# EAGLE design clock (EAGLE 9.6.2)
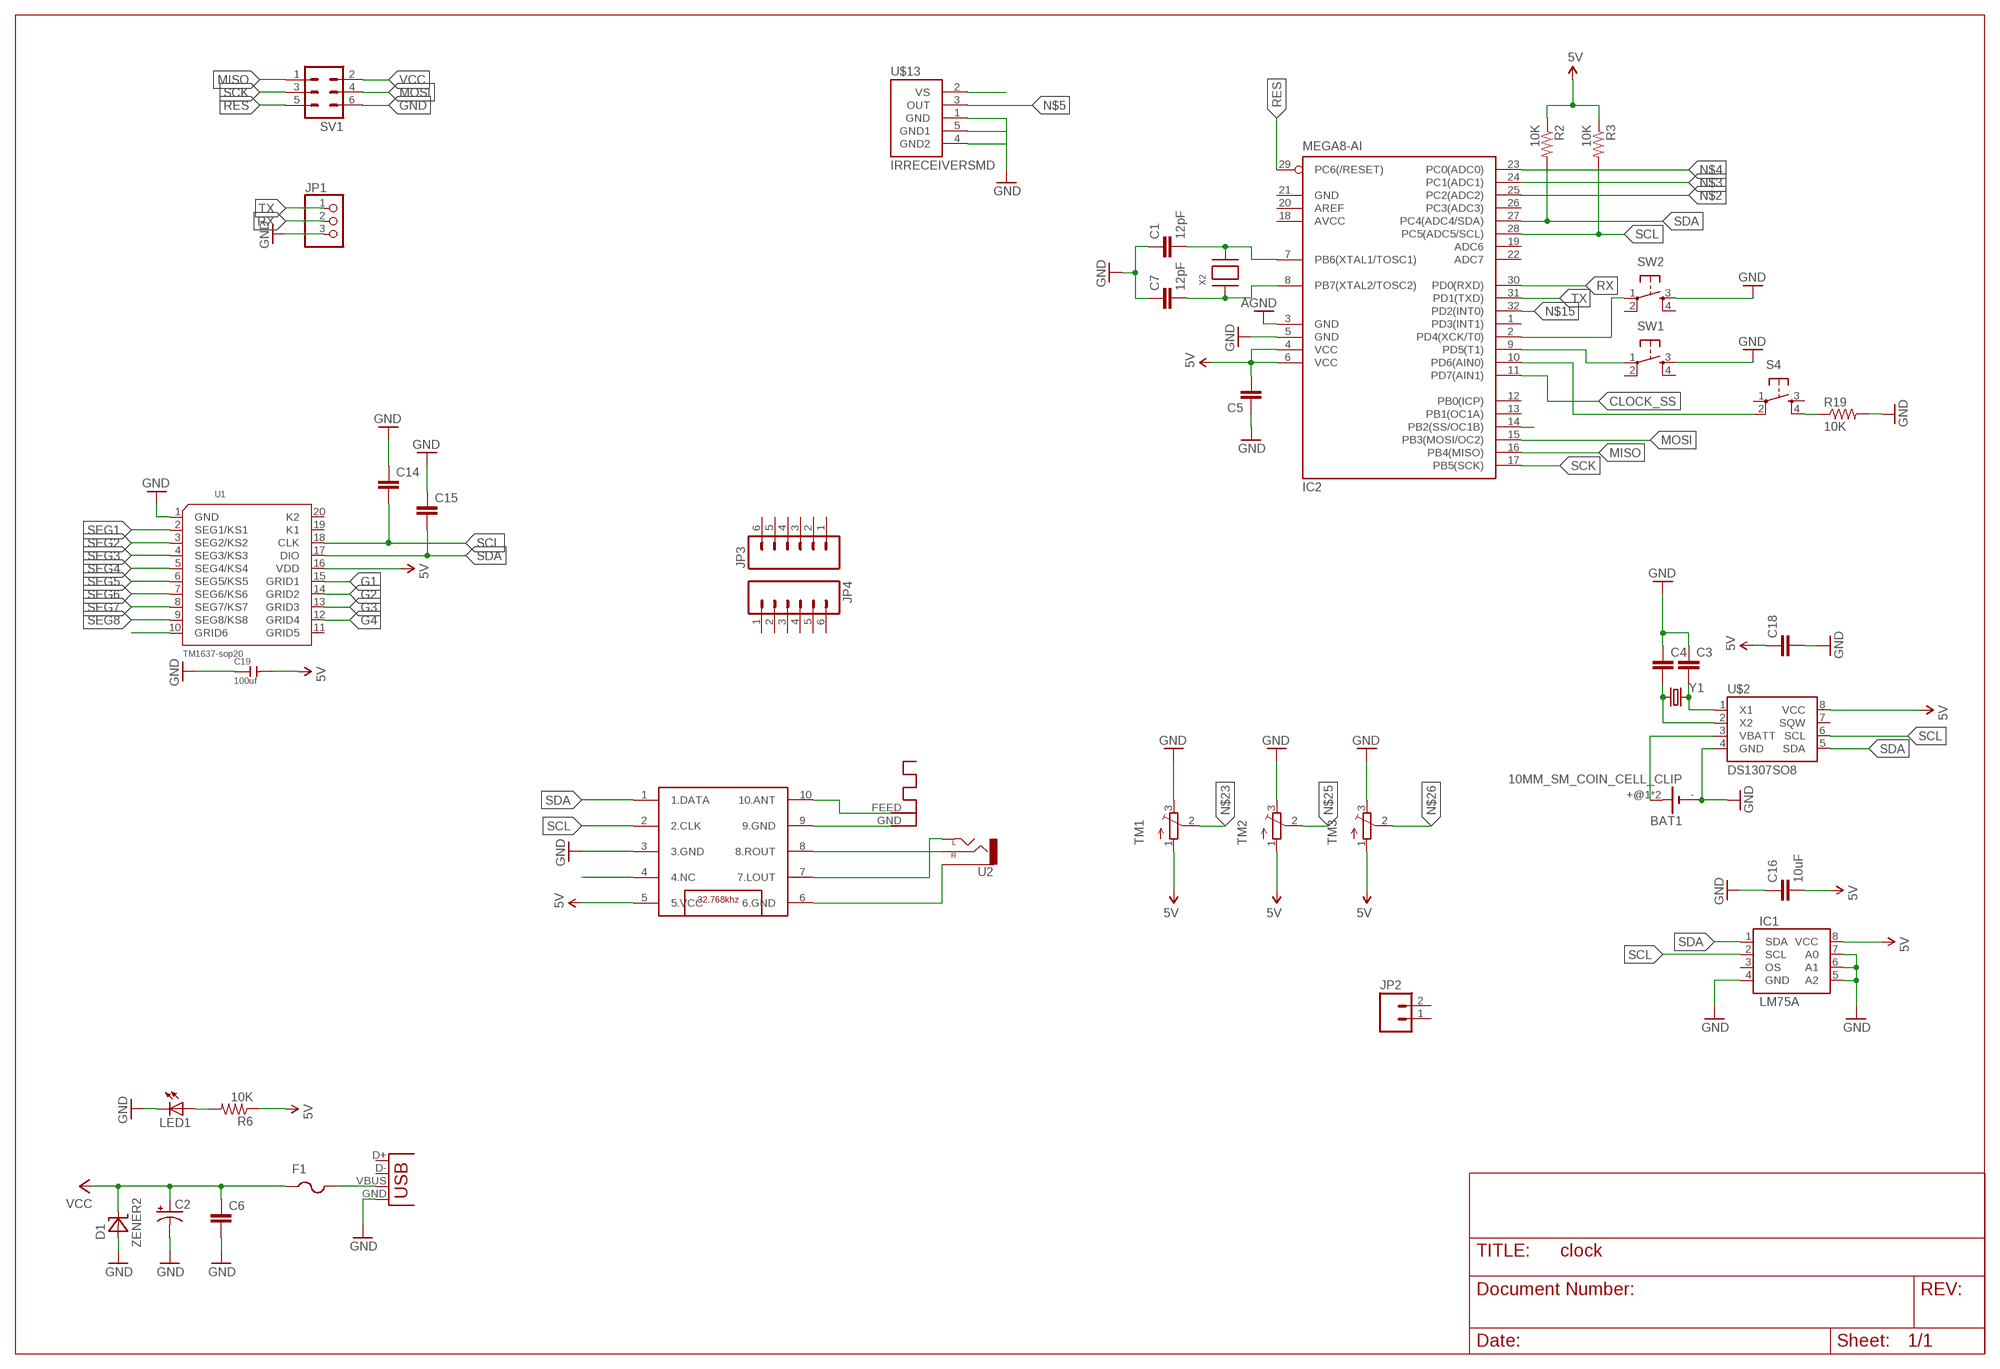
[diagram p0: schematic, sheet 1]

## Parts
ANT1  ANTENNA  [RN-ANT]
BAT1  10MM_SM_COIN_CELL_CLIP  [10MM_SM_COIN_CELL_CLIP]
C1  12pF  C-EUC0603  [C0603]
C2  CPOL-USB  [PANASONIC_B]
C3  C-EUC0603  [C0603]
C4  C-EUC0603  [C0603]
C5  C-EUC0603  [C0603]
C6  C-EUC0603  [C0603]
C7  12pF  C-EUC0603  [C0603]
C14  C-EUC0603  [C0603]
C15  C-EUC0603  [C0603]
C16  10uF  C-EUC0603  [C0603]
C18  C-EUC0603  [C0603]
C19  100uf  CERAMIC-100UF-6.3V-20%-X5R(1206)  [C1206]
D1  ZENER2  [SOD123]
F1  PTCFUSE-1206  [R1206]
IC1  LM75A  [SO8]
IC2  MEGA8-AI  [TQFP32-08]
JP1  PINHD-1X3CB  [1X03-CLEANBIG]
JP2  M02PTH  [1X02]
JP3  M06SIP  [1X06]
JP4  M06SIP  [1X06]
LED1  LED0603  [LED-0603]
R2  10K  R-US_R0603  [R0603]
R3  10K  R-US_R0603  [R0603]
R6  10K  R-US_R0603  [R0603]
R19  10K  R-US_R0603  [R0603]
S4  TAC_SWITCHSMD  [TACTILE_SWITCH_SMD]
SV1  MA03-2  [MA03-2]
SW1  TAC_SWITCHSMD  [TACTILE_SWITCH_SMD]
SW2  TAC_SWITCHSMD  [TACTILE_SWITCH_SMD]
TM1  TRIMPOTTC33X  [TC33X]
TM2  TRIMPOTTC33X  [TC33X]
TM3  TRIMPOTTC33X  [TC33X]
U1  TM1637-sop20  DRIVER-TM1637(SOP20)  [SOP20-1.27-12.7X7.65MM]
U2  AUDIO-JACKSMD  [STEREOJACK2.5MM_SMD]
U$2  DS1307SO8  [SO08]
U$13  IRRECEIVERSMD  [TSOP8523]
U$14  TEA5767  [TJ-102BC]
X1  USB-MICROB  [USB-MICROB]
X2  XTAL-3.2X1.5  [XTAL3215]
Y1  CRYSTALTC26H  [TC26H]

## Nets
5V: C5.2 C16.2 C18.1 C19.2 IC1.8(VCC) IC2.4(VCC) IC2.6(VCC) R2.1 R3.1 R6.1 TM1.1(A) TM2.1(A) TM3.1(A) U1.16(VDD) U$2.8(VCC) U$14.5(5.VCC)
AGND: IC2.3(GND)
CLOCK_SS: IC2.11(PD7(AIN1))
G1: U1.15(GRID1)
G2: U1.14(GRID2)
G3: U1.13(GRID3)
G4: U1.12(GRID4)
GND: BAT1.- C1.1 C2.- C3.1 C4.1 C5.1 C6.2 C7.1 C14.1 C15.1 C16.1 C18.2 C19.1 D1.A IC1.4(GND) IC1.5(A2) IC1.6(A1) IC1.7(A0) IC2.5(GND) JP1.3 LED1.C R19.2 SV1.6 SW1.3 SW2.3 TM1.3(E) TM2.3(E) TM3.3(E) U1.1(GND) U$2.4(GND) U$13.1(GND) U$13.4(GND2) U$13.5(GND1) U$14.3(3.GND) X1.GND
MISO: IC2.16(PB4(MISO)) SV1.1
MOSI: IC2.15(PB3(MOSI/OC2)) SV1.4
N$2: IC2.25(PC2(ADC2))
N$3: IC2.24(PC1(ADC1))
N$4: IC2.23(PC0(ADC0))
N$5: U$13.3(OUT)
N$6: U2.5(SLEEVE) U$14.6(6.GND)
N$7: U2.4(RIGHT) U$14.8(8.ROUT)
N$8: BAT1.+@1(+) BAT1.+@2(+) U$2.3(VBATT)
N$9: U2.1(LEFT) U$14.7(7.LOUT)
N$10: C4.2 U$2.2(X2) Y1.1
N$11: C3.2 U$2.1(X1) Y1.2
N$12: ANT1.FEED U$14.10(10.ANT)
N$14: IC2.9(PD5(T1)) SW1.1
N$15: IC2.32(PD2(INT0))
N$16: ANT1.GND U$14.9(9.GND)
N$18: U$14.4(4.NC)
N$19: IC2.2(PD4(XCK/T0)) SW2.1
N$20: U$13.2(VS)
N$23: TM1.2(S)
N$24: U1.10(GRID6)
N$25: TM2.2(S)
N$26: TM3.2(S)
N$47: IC2.10(PD6(AIN0)) S4.2
N$49: IC2.14(PB2(SS/OC1B))
N$52: F1.2 X1.VBUS
N$54: C1.2 IC2.7(PB6(XTAL1/TOSC1)) X2.P$2
N$57: R19.1 S4.4
N$58: C7.2 IC2.8(PB7(XTAL2/TOSC2)) X2.P$1
N$60: LED1.A R6.2
RES: IC2.29(PC6(/RESET)) SV1.5
RX: IC2.30(PD0(RXD)) JP1.2
SCK: IC2.17(PB5(SCK)) SV1.3
SCL: C14.2 IC1.2(SCL) IC2.28(PC5(ADC5/SCL)) R3.2 U1.18(CLK) U$2.6(SCL) U$14.2(2.CLK)
SDA: C15.2 IC1.1(SDA) IC2.27(PC4(ADC4/SDA)) R2.2 U1.17(DIO) U$2.5(SDA) U$14.1(1.DATA)
SEG1: U1.2(SEG1/KS1)
SEG2: U1.3(SEG2/KS2)
SEG3: U1.4(SEG3/KS3)
SEG4: U1.5(SEG4/KS4)
SEG5: U1.6(SEG5/KS5)
SEG6: U1.7(SEG6/KS6)
SEG7: U1.8(SEG7/KS7)
SEG8: U1.9(SEG8/KS8)
TX: IC2.31(PD1(TXD)) JP1.1
VCC: C2.+ C6.1 D1.C F1.1 SV1.2
Unconnected: IC1.3(OS) IC2.1(PD3(INT1)) IC2.12(PB0(ICP)) IC2.13(PB1(OC1A)) IC2.19(ADC6) IC2.20(AREF) IC2.22(ADC7) IC2.26(PC3(ADC3)) JP2.1 JP2.2 JP3.1 JP3.2 JP3.3 JP3.4 JP3.5 JP3.6 JP4.1 JP4.2 JP4.3 JP4.4 JP4.5 JP4.6 S4.1 S4.3 SW1.2 SW1.4 SW2.2 SW2.4 U1.11(GRID5) U1.19(K1) U1.20(K2) U$2.7(SQW) X1.D+ X1.D-

## Power pins joined to a net without a drawn wire
AVCC: IC2.18(AVCC)
GND: IC2.21(GND)

## Library data of the parts
ANT1 = adafruit:ANTENNA
BAT1 = battery:10MM_SM_COIN_CELL_CLIP: Battery cell clip for CR927 Source: KEYSTONE ELECTRONICS CORP. www.keyelco.com, ASTORIA, N.Y. 11105-2017 PART ANME 10mm SM COIN CELl CLIP DWG NO. 3030
C1 C3-C7 C14-C16 C18 = rcl:C-EU: CAPACITOR, European symbol
C2 = adafruit:CPOL-US: POLARIZED CAPACITOR, American symbol
C19 = Seeed-Capacitor:CERAMIC-100UF-6.3V-20%-X5R(1206): 302010183; MPN: GRM31CR60J107ME39L
D1 = smt_diodes:ZENER
F1 = adafruit:PTCFUSE: PTC fuses, resettable thermistors
IC1 = philips-6:LM75A
IC2 = atmel:MEGA8: MICROCONTROLLER 8 Kbytes FLASH, 1 kbytes SRAM, 512 bytes EEPROM, USART, 6-channel 10 bit ADC, 2-channel 8 bit ADC Pin compatible with Atmega48, ATMega88, ATMega168 Source: avr.lbr; MPN: ATMEGA8-16AU; OC_FARNELL: 9171371; OC_NEWARK: 73M8863
JP1 = adafruit:PINHD-1X3: PIN HEADER
JP2 = SparkFun:M02: Header 2 Standard 2-pin 0.1" header. Use with straight break away headers (SKU : PRT-00116), right angle break away headers (PRT-00553), swiss pins (PRT-00743), machine pins (PRT-00117), and female headers (PRT-00115). Molex polarized connector foot print use with SKU : PRT-08233 with associated crimp pins and housings.
JP3 JP4 = SparkFun:M06: Header 6 Standard 6-pin 0.1" header. Use with straight break away headers (SKU : PRT-00116), right angle break away headers (PRT-00553), swiss pins (PRT-00743), machine pins (PRT-00117), and female headers (PRT-00115). Molex polarized connector foot print use with SKU : PRT-08094 with associated crimp pins and housings. NOTES ON THE VARIANTS LOCK and LOCK_LONGPADS... This footprint was designed to help hold the alignment of a through-hole component (i.e. 6-pin header) while soldering it into place. You may notice that each hole has been shifted either up or down by 0.005 of an inch from it's more standard position (which is a perfectly straight line). This slight alteration caused the pins (the squares in the middle) to touch the edges of the holes. Because they are alternating, it causes a "brace" to hold the component in place. 0.005 has proven to be the perfect amount of "off-center" position when using our standard breakaway headers. Although looks a little odd when you look at the bare footprint, once you have a header in there, the alteration is very hard to notice. Also, if you push a header all the way into place, it is covered up entirely on the bottom side. This idea of altering the position of holes to aid alignment will be further integrated into the Sparkfun Library for other footprints. It can help hold any component with 3 or more connection pins.
LED1 = SparkFun:LED: LEDs Standard schematic elements and footprints for 5mm, 3mm, 1206, and 0603 sized LEDs. 5mm - Spark Fun Electronics SKU : COM-00529 (and others)
R2 R3 R6 R19 = rcl:R-US_: RESISTOR, American symbol
S4 SW1 SW2 = SparkFun:TAC_SWITCH: Momentary Switch Button commonly used for reset or general input. Spark Fun Electronics SKU : COM-00097
SV1 = con-lstb:MA03-2: PIN HEADER; OC_FARNELL: unknown; OC_NEWARK: unknown
TM1-TM3 = adafruit:TRIMPOT: SMT trimmer potentiometer part number TC33X http://www.ladyada.net/library/eagle
U1 = Seeed-IC:DRIVER-TM1637(SOP20): 310040027; MPN: TM1637
U2 = SparkFun:AUDIO-JACK: 3.5mm Audio Jack Simple 3.5mm common PCB mount audio jack. SKU: PRT-08032
U$2 = SparkFun:DS1307
U$13 = SparkFun:IRRECEIVER: Description: IR receiver with built in demodulation and filtering. SparkFun SKU: SEN-08545
U$14 = TEA5767:TEA5767
X1 = SparkFun:USB: USB Connectors USB-B-PTH is fully proven SKU : PRT-00139 USB-miniB is fully proven SKU : PRT-00587 USB-A-PCB is untested. USB-A-H is throughly reviewed, but untested. Spark Fun Electronics SKU : PRT-00437 USB-B-SMT is throughly reviewed, but untested. Needs silkscreen touching up. USB-A-S has not been used/tested USB-MB-H has not been used/tested
X2 = adafruit:XTAL: Low cost SMT crystals, no capacitors included http://www.ladyada.net/library/eagle
Y1 = SparkFun:CRYSTAL: Crystals Various standard crystals. Proven footprints. Spark Fun Electronics SKU : COM-00534

## Board
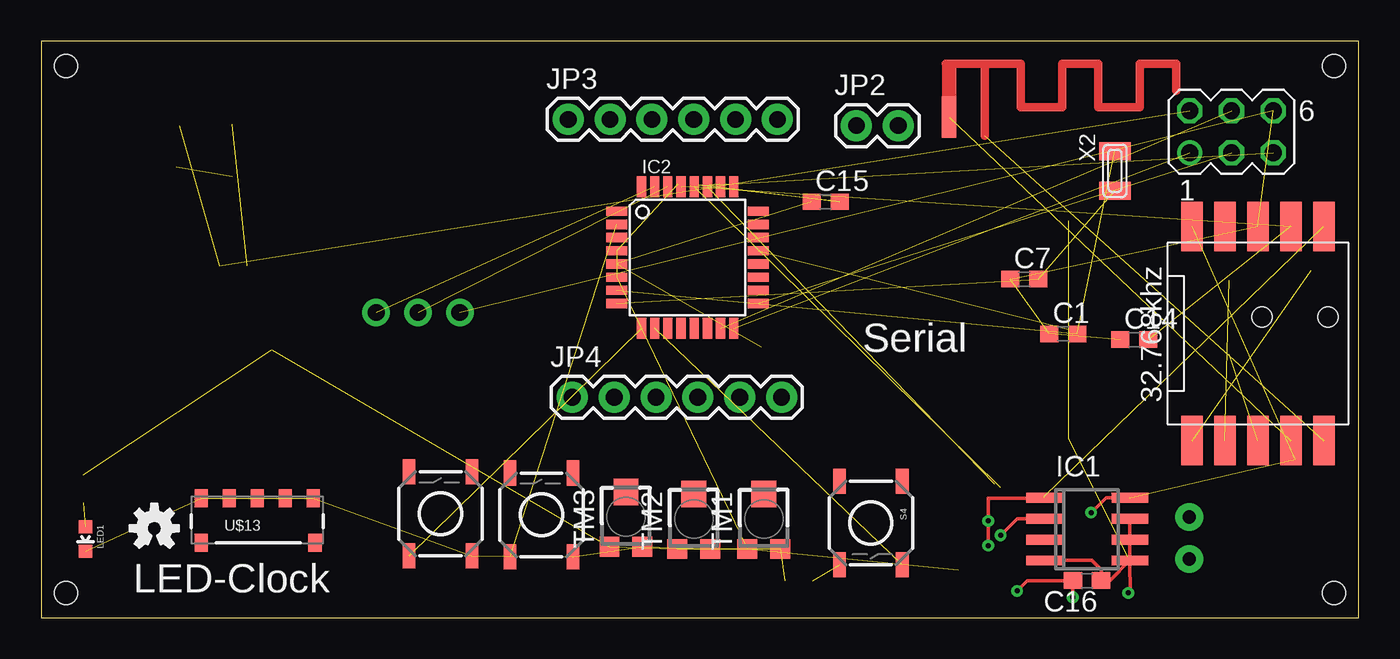
[diagram p1: board, top side]
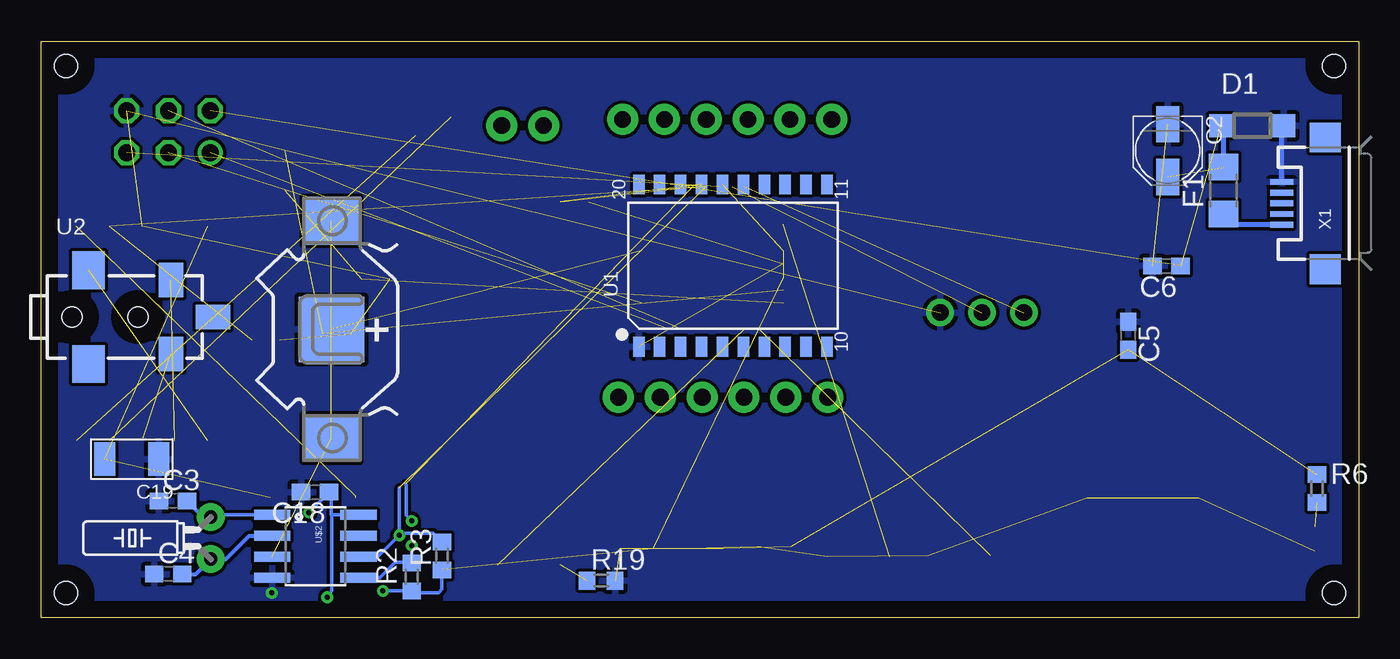
[diagram p2: board, bottom side, seen from below]

Size 80 x 35 mm. Coordinates in mm from the lower left corner, seen from the top.
Outline: 0,0 80,0 80,35 0,35 0,0
Copper layers (1*16): Top 0.035mm / dielectric 1.5mm / Bottom 0.035mm
Design rules "default *": minimum track width 8mil, minimum drill 12mil, track to track 8mil, track to pad 8mil, pad to pad 8mil, via to via 8mil, smd to smd 8mil, copper to edge 40mil, drill to drill 8mil, minimum pad ring 10mil, minimum via ring 8mil, stop-mask expansion 4mil, vias tented up to drill 0mil, thermal gap 10mil
Holes 1.4 mm at 78.5,33.5 1.5,33.5 78.5,1.5 1.5,1.5

### Footprints (pad centres in the part's own frame; a part is rotated, then mirrored left to right if it is on the bottom)
RN-ANT = smd 0.025 x 0.025: FEED 0,2.159 | smd 2.54 x 0.889: GND -1.143,0
10MM_SM_COIN_CELL_CLIP = smd 2.9 x 3.5: +@1 -6.6,0; +@2 6.6,0 | smd 3.96 x 3.96: - 0,0
C0603 = smd 1.1 x 1: 1 -0.85,0; 2 0.85,0
PANASONIC_B = smd 2.2 x 1.4: + 1.6,0; - -1.6,0
C1206 = smd 1.27 x 2.032: 1 -1.651,0; 2 1.651,0
SOD123 = smd 1.4 x 1.4: A 1.9,0; C -1.9,0
R1206 = smd 1.6 x 1.803: 1 -1.422,0; 2 1.422,0
SO8 = smd 0.6 x 2.2: 1 -1.905,-2.6; 2 -0.635,-2.6; 3 0.635,-2.6; 4 1.905,-2.6; 5 1.905,2.6; 6 0.635,2.6; 7 -0.635,2.6; 8 -1.905,2.6
TQFP32-08 = smd 1.27 x 0.559: 1 -4.293,2.8; 2 -4.293,2; 3 -4.293,1.2; 4 -4.293,0.4; 5 -4.293,-0.4; 6 -4.293,-1.2; 7 -4.293,-2; 8 -4.293,-2.8; 17 4.293,-2.8; 18 4.293,-2; 19 4.293,-1.2; 20 4.293,-0.4; 21 4.293,0.4; 22 4.293,1.2; 23 4.293,2; 24 4.293,2.8 | smd 0.559 x 1.27: 9 -2.8,-4.293; 10 -2,-4.293; 11 -1.2,-4.293; 12 -0.4,-4.293; 13 0.4,-4.293; 14 1.2,-4.293; 15 2,-4.293; 16 2.8,-4.293; 25 2.8,4.293; 26 2,4.293; 27 1.2,4.293; 28 0.4,4.293; 29 -0.4,4.293; 30 -1.2,4.293; 31 -2,4.293; 32 -2.8,4.293
1X03-CLEANBIG = drill 1.016 pad 1.676: 1 -2.54,0; 2 0,0; 3 2.54,0
1X02 = drill 1.016 pad 1.88: 1 0,0; 2 2.54,0
1X06 = drill 1.016 pad 1.88: 1 0,0; 2 2.54,0; 3 5.08,0; 4 7.62,0; 5 10.16,0; 6 12.7,0
LED-0603 = smd 0.8 x 0.8: A 0,-0.75; C 0,0.75
R0603 = smd 1 x 1.1: 1 -0.85,0; 2 0.85,0
TACTILE_SWITCH_SMD = smd 1.524 x 0.762: 1 -2.54,1.905; 2 2.54,1.905; 3 -2.54,-1.905; 4 2.54,-1.905
MA03-2 = drill 1.016: 1 -2.54,-1.27 | drill 1.016 octagon: 2 -2.54,1.27; 3 0,-1.27; 4 0,1.27; 5 2.54,-1.27; 6 2.54,1.27
TC33X = smd 1.2 x 1.2: 1 -1,-1.825; 3 1,-1.825 | smd 1.5 x 1.6: 2 0,1.5
SOP20-1.27-12.7X7.65MM = smd 0.7 x 1.2: 1 -5.715,-4.925; 2 -4.445,-4.925; 3 -3.175,-4.925; 4 -1.905,-4.925; 5 -0.635,-4.925; 6 0.635,-4.925; 7 1.905,-4.925; 8 3.175,-4.925; 9 4.445,-4.925; 10 5.715,-4.925; 11 5.715,4.925; 12 4.445,4.925; 13 3.175,4.925; 14 1.905,4.925; 15 0.635,4.925; 16 -0.635,4.925; 17 -1.905,4.925; 18 -3.175,4.925; 19 -4.445,4.925; 20 -5.715,4.925
STEREOJACK2.5MM_SMD = smd 1.5 x 2.1: 1 6,2.25; 4 6,-2.25 | smd 2.1 x 1.5: 3 8.55,0 | smd 2 x 2.3: 5 1,2.85; A 1,-2.85 | hole 1.2: 0,0; 4,0
SO08 = smd 0.61 x 2.21: 1 -1.905,-2.616; 2 -0.635,-2.616; 3 0.635,-2.616; 4 1.905,-2.616; 5 1.905,2.616; 6 0.635,2.616; 7 -0.635,2.616; 8 -1.905,2.616
TSOP8523 = smd 0.8 x 1.1: 1 3.4,0; 2 1.7,0; 3 0,0; 4 -1.7,0; 5 -3.4,0; P$1 -3.4,-2.7; P$2 3.5,-2.7
TJ-102BC = smd 3 x 1.3: 1 -2,0.5; 2 -2,-1.5; 3 -2,-3.5; 4 -2,-5.5; 5 -2,-7.5; 6 11,-7.5; 7 11,-5.5; 8 11,-3.5; 9 11,-1.5; 10 11,0.5
USB-MICROB = smd 0.35 x 1.4: D+ 0,2.65; D- -0.65,2.65; GND 1.3,2.65; ID 0.65,2.65; VBUS -1.3,2.65 | smd 1.8 x 1.9: MT1 -4,0; MT2 4,0
XTAL3215 = smd 1.1 x 1.9: P$1 1.2,0; P$2 -1.2,0
TC26H = drill 0.813 pad 1.676: 1 -1.27,0; 2 1.27,0

### Placement (x,y rotation side)
ANT1  55.12,29.25 270 top
BAT1  62.38,17.5 270 bottom
C1  62.05,17.23 0 top
C2  11.61,28.36 270 bottom
C3  72,7.08 0 bottom
C4  72.28,2.65 0 bottom
C5  14,17.12 270 bottom
C6  11.68,21.36 180 bottom
C7  59.68,20.55 0 top
C14  66.38,16.88 0 top
C15  47.62,25.25 0 top
C16  63.5,2.25 180 top
C18  63.38,7.62 180 bottom
C19  74.5,9.62 180 bottom
D1  6.47,29.88 0 bottom
F1  8.21,25.93 270 bottom
IC1  63.5,5.38 270 top
IC2  39.25,21.88 0 top
JP1  22.88,18.52 0 top
JP2  49.5,29.88 0 top
JP3  32,30.25 0 top
JP4  32.25,13.38 0 top
LED1  2.69,4.78 180 top
R2  57.5,2.48 90 bottom
R3  55.66,3.75 90 bottom
R6  2.54,7.84 270 bottom
R19  46,2.25 0 bottom
S4  50.38,5.75 270 top
SV1  72.27,29.5 0 top
SW1  24.25,6.31 90 top
SW2  30.38,6.24 90 top
TM1  43.88,6 0 top
TM2  39.62,6 0 top
TM3  35.5,6.12 0 top
U1  38,21.38 0 bottom
U2  78.12,18.25 0 bottom
U$2  63.35,4.33 270 bottom
U$6  [OSHW-LOGO-S]  6.87,5.42 0 top
U$13  13.12,7.25 0 top
U$14  77.38,21.75 270 top
X1  2.04,25.16 90 bottom
X2  65.19,27.11 270 top
Y1  69.7,4.83 90 bottom

### Tracks (layer width: path | path; a pad name or v marks a point on that pad's centre or on a via)
5V  (via drill 0.3)  (10 unrouted)
  Top 0.203: v59.25,1.62 59.88,2.25 C16.2 62.62,2.23 v62.62,1.24 | v63.75,6.38 64.66,7.28 IC1.8
  Bottom 0.203: v59.25,1.62 v59.24,1.63 R2.1 57.37,1.5 55.88,1.5 55.66,1.71 R3.1 | 62.36,6.24 62.38,6.25 62.38,7.47 C18.1 63.75,6.4 v63.75,6.38 | 62.36,6.24 U$2.8 | v62.62,1.24 62.36,1.63 62.36,6.24
GND  (via drill 0.3)  (18 unrouted)
  Top 0.203: IC1.7 IC1.6 IC1.5 | IC1.4 63.78,3.47 64.35,2.9 C16.1 64.88,2.25 IC1.5 | IC1.5 66.12,1.45 v66,1.5
  Bottom 0.305: X1.GND 4.69,29.75 D1.A
  pour Bottom: -1.27,36.83 81.28,36.83 81.28,-2.54 -1.27,-2.54
MISO  (1 unrouted)
MOSI  (1 unrouted)
N$1
  pour Bottom (isolate 0.406, hatched): 64.75,4.38 68.12,4.38 68.25,1.75 74.38,1.75 74.38,7.88 73.12,7.88 73.12,8.75 66.62,8.75 65.5,6.62 64.75,5.88
N$6  (1 unrouted)
N$7  (1 unrouted)
N$8  (2 unrouted)
N$9  (1 unrouted)
N$10
  Bottom 0.203: 66.38,4.96 U$2.2 66.38,4.96 | 69.7,3.67 Y1.1 | 66.41,5 66.38,4.96
  Bottom 0.254: C4.2 70.62,2.65 Y1.1 68.78,3.56 67.38,4.96 66.38,4.96
N$11  (via drill 0.35)
  Top 0.203: v69.78,6.17 Y1.2
  Bottom 0.203: U$2.1 69.5,6.24 69.57,6.24 Y1.2
  Bottom 0.254: C3.2 70.31,6.24 69.5,6.24
N$12  (1 unrouted)
N$14  (1 unrouted)
N$16  (1 unrouted)
N$19  (1 unrouted)
N$47  (1 unrouted)
N$52
  Bottom 0.305: X1.VBUS 7.55,23.86 F1.2
N$54  (2 unrouted)
N$57  (1 unrouted)
N$58  (2 unrouted)
N$60  (1 unrouted)
RES  (1 unrouted)
RX  (1 unrouted)
SCK  (1 unrouted)
SCL  (via drill 0.3)  (4 unrouted)
  Top 0.203: IC1.2 59.26,6.01 v58.25,5
  Bottom 0.203: U$2.6 60.68,3.75 59.5,3.75 v58.25,5 | R3.2 56.19,5.12 58.12,5.12 v58.25,5 | v58.25,5 58.25,7.88
SDA  (via drill 0.3)  (5 unrouted)
  Top 0.203: v57.5,4.38 v57.5,5.88 57.5,7.25 60.31,7.25 60.44,7.38 60.9,7.38
  Bottom 0.203: U$2.5 59.45,2.42 58.5,3.38 57.55,3.38 R2.2 v57.5,4.38 | v57.5,5.88 57.84,6.22 57.84,8.04 57.88,8.07 57.88,8.12
TX  (1 unrouted)
VCC  (3 unrouted)
  Bottom 0.305: F1.1 8.21,29.71 D1.C

### Text on the board
tPlace: Serial | LED-Clock